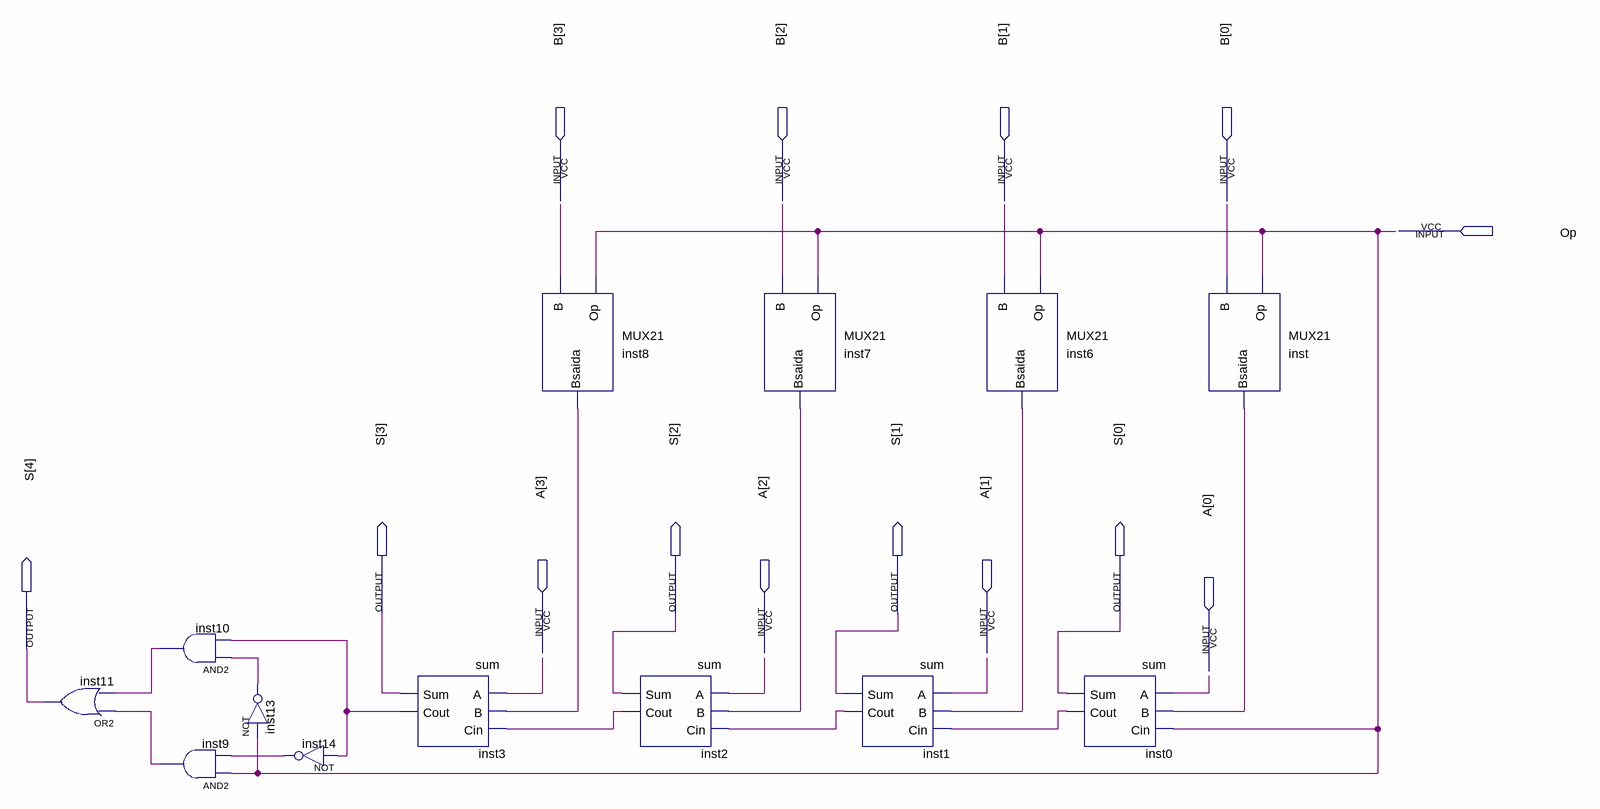
[diagram p0: schematic sheet]
// Quartus schematic SUM4.bdf as structural Verilog: 13 symbols, 14 pins
module SUM4 (
  input  [3:0] B,
  input  Op,
  input  [3:0] A,
  output [4:0] S
);

  wire inst0_cout, inst1_cout, inst2_cout, inst3_cout, inst6_bsaida, inst7_bsaida, inst8_bsaida, inst9_out,
       inst10_out, inst13_out, inst14_out, inst_bsaida;

  or inst11 (S[4], inst9_out, inst10_out);
  and inst10 (inst10_out, inst13_out, inst3_cout);
  and inst9 (inst9_out, Op, inst14_out);
  not inst13 (inst13_out, Op);
  not inst14 (inst14_out, inst3_cout);
  sum inst3 (.A(A[3]), .B(inst8_bsaida), .Cin(inst2_cout), .Sum(S[3]), .Cout(inst3_cout));
  MUX21 inst8 (.B(B[3]), .Op(Op), .Bsaida(inst8_bsaida));
  sum inst2 (.A(A[2]), .B(inst7_bsaida), .Cin(inst1_cout), .Sum(S[2]), .Cout(inst2_cout));
  MUX21 inst7 (.B(B[2]), .Op(Op), .Bsaida(inst7_bsaida));
  sum inst1 (.A(A[1]), .B(inst6_bsaida), .Cin(inst0_cout), .Sum(S[1]), .Cout(inst1_cout));
  MUX21 inst6 (.B(B[1]), .Op(Op), .Bsaida(inst6_bsaida));
  sum inst0 (.A(A[0]), .B(inst_bsaida), .Cin(Op), .Sum(S[0]), .Cout(inst0_cout));
  MUX21 inst (.B(B[0]), .Op(Op), .Bsaida(inst_bsaida));
endmodule
